# Altium schematic sheet MAZ000167 - Diagrama físico.SchDoc: MAZ000167 - Diagrama físico
size A; ApprovedBy: Christian Ledwidth; CheckedBy: Nahuel Martinez; Author: Santiago Marti; CompanyName: Body Health; DrawnBy: Santiago Marti; Revision: A; SheetNumber: 2; SheetTotal: 2
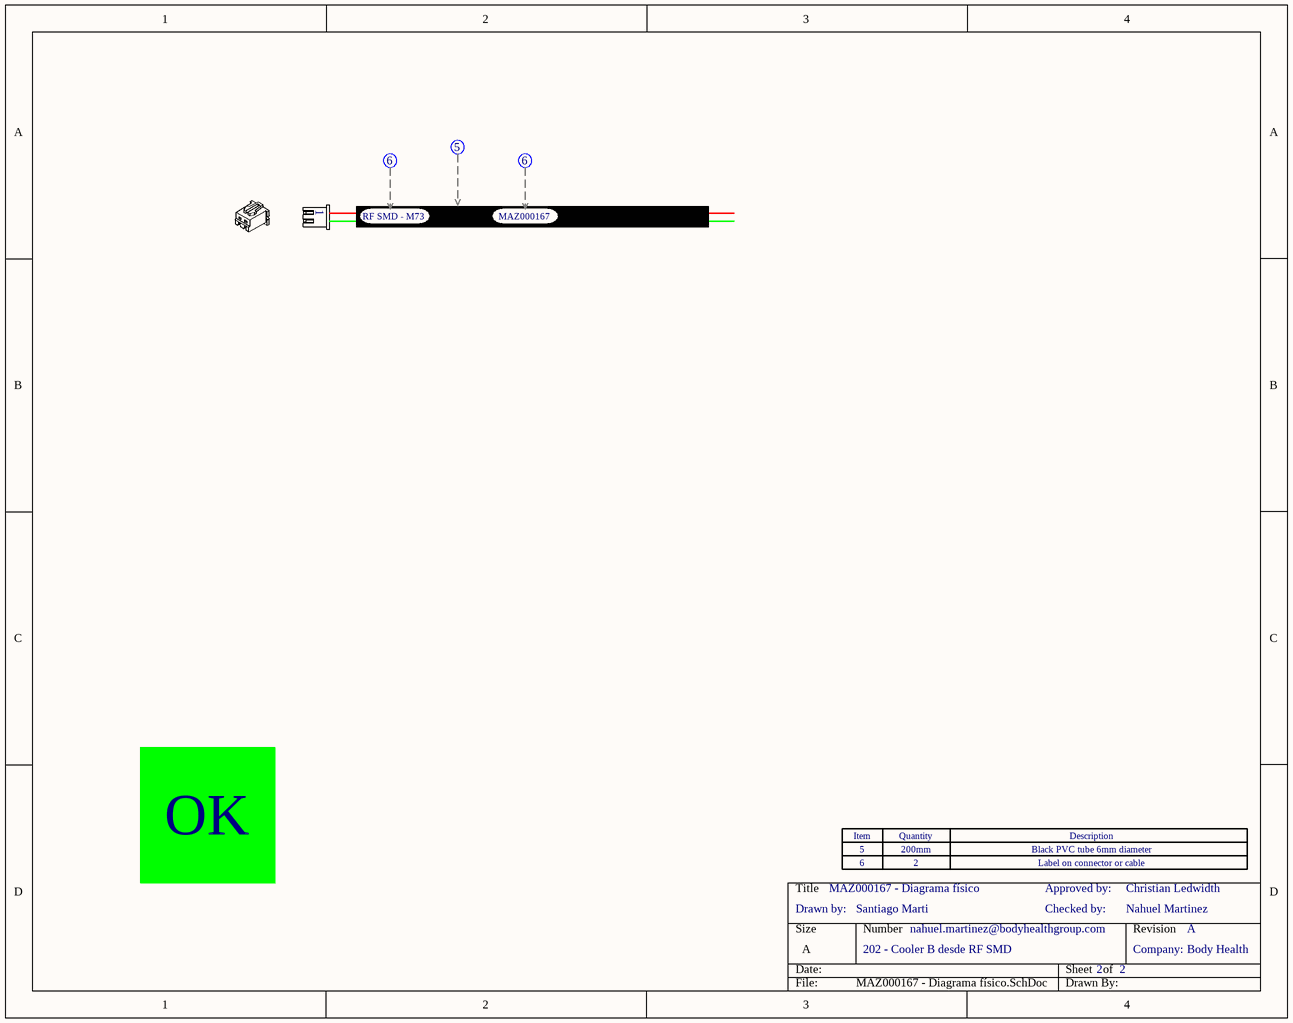
[diagram p0: MAZ000167 - Diagrama físico.SchDoc]

## Parts
(Parts that share a designator on the sheet are numbered #1, #2 ... from top to bottom, then left to right.)
Con1  XHP-2  (value not drawn)  (parts A,B,C of 4)
Con2  XHP-2  (value not drawn)  (part C of 4)
Con3  XHP-2  (value not drawn)  (part C of 4)
Zoc?#1  Zócalo_Header  (value not drawn)
Zoc?#2  Zócalo_Item  (value not drawn)
Zoc?#3  Zócalo_Item  (value not drawn)

## Notes on the sheet
- RF SMD - M73
- MAZ000167
- OK
- (near Zoc?#3) Drawn by:
- (near Zoc?#1) 5
- (near Zoc?#2) 6
- 200mm
- 2
- Checked by:
- Approved by:
- Black PVC tube 6mm diameter
- Label on connector or cable
- 202 - Cooler B desde RF SMD
- nahuel.martinez@bodyhealthgroup.com
- Company:
- (in symbol Zócalo_Header) Item; Quantity; Description

## Library data of the parts
Con1 = XHP-2: CONN HOUSING 2.5MM 2POS; Fabricante: JST Sales America Inc.; Cod.DigiKey: 455-2266-ND; Cod.Fabricante: XHP-2; ComponentLink1Description: Manufacturer Link; ComponentLink1URL: http://www.jst-mfg.com/product/pdf/eng/eXH.pdf; DIGIKEYx50: 0.05620; CallOut: *; DIGIKEYx100: NO
Con2 Con3 = XHP-2: CONN HOUSING 2.5MM 2POS; Fabricante: JST Sales America Inc.; CallOut: 6; Cod.DigiKey: 455-2266-ND; Cod.Fabricante: XHP-2; ComponentLink1Description: Manufacturer Link; ComponentLink1URL: http://www.jst-mfg.com/product/pdf/eng/eXH.pdf; DIGIKEYx50: 0.05620; DIGIKEYx100: NO
Zoc?#1 = Zócalo_Header: Header para el zócalo de referencias
Zoc?#2 Zoc?#3 = Zócalo_Item: Ítem para el zócalo de referencias; Desginator: *; Quantity: *; ItemDescription: *